# EAGLE design Sensor PCB (EAGLE 9.2.2)
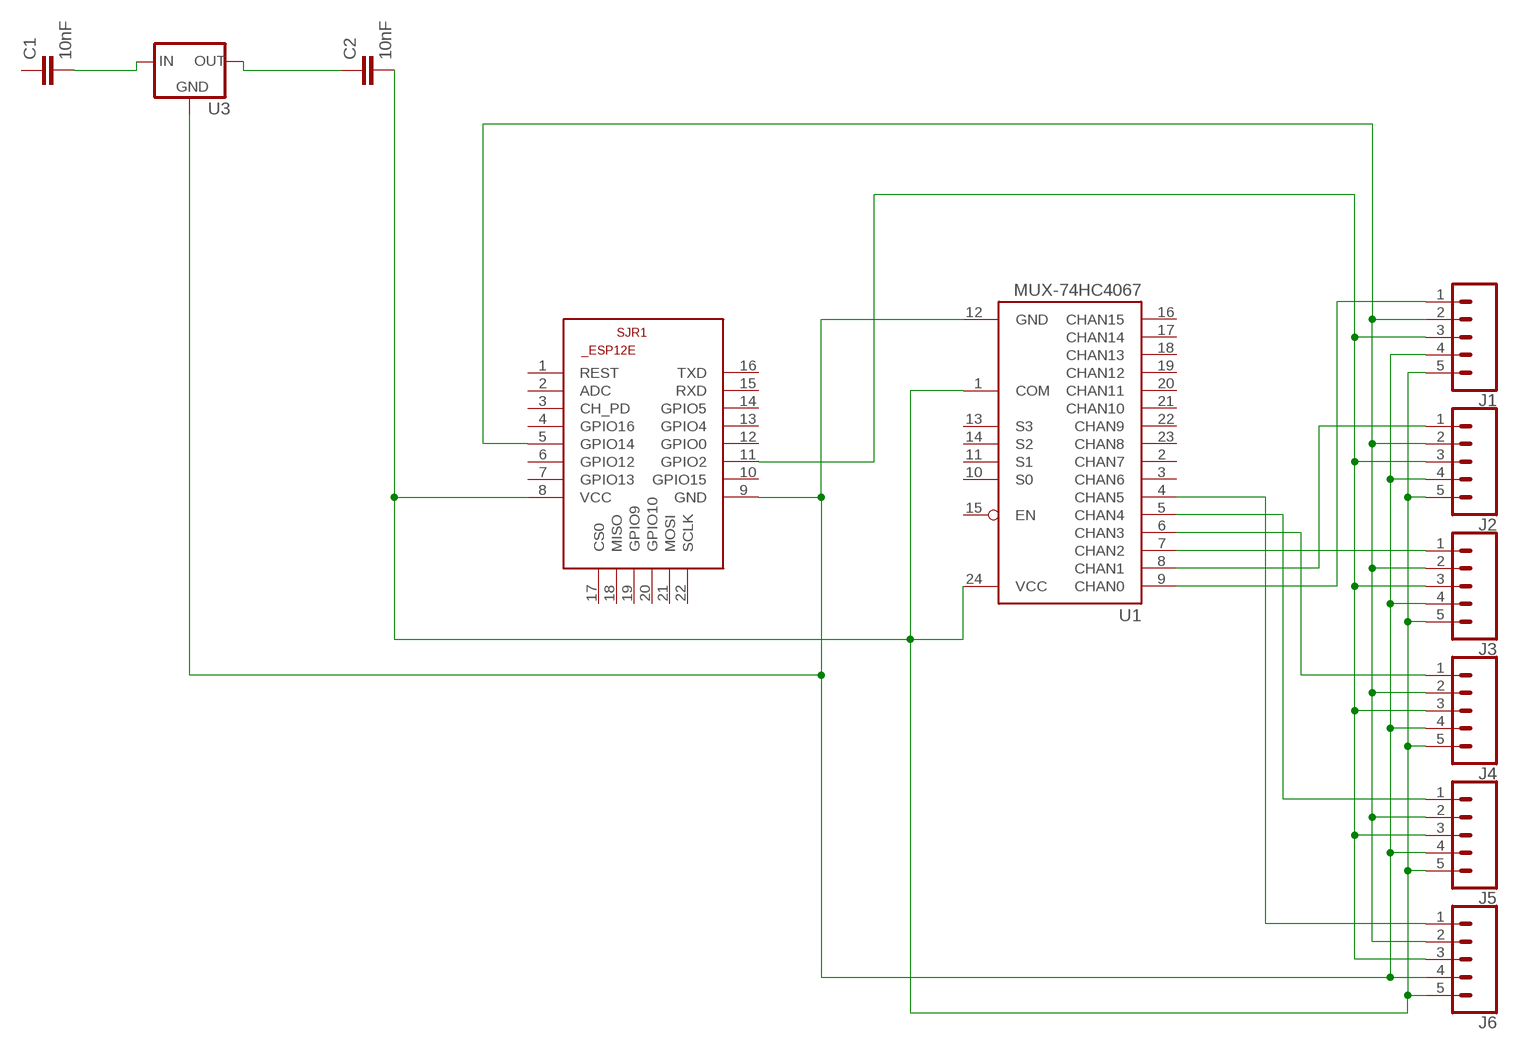
[diagram p0: schematic, sheet 1]

## Parts
C1  10nF  10NF-0603-50V-10%  [0603]
C2  10nF  10NF-0603-50V-10%  [0603]
J1  CONN_05JST-VERT  [JST-5-PTH-VERT]
J2  CONN_05JST-VERT  [JST-5-PTH-VERT]
J3  CONN_05JST-VERT  [JST-5-PTH-VERT]
J4  CONN_05JST-VERT  [JST-5-PTH-VERT]
J5  CONN_05JST-VERT  [JST-5-PTH-VERT]
J6  CONN_05JST-VERT  [JST-5-PTH-VERT]
SJR1  ESP8266-12EESP12E  [ESP8266-ESP12E]
U1  MUX-74HC4067  MUX-74HC4067SMD  [SSOP24]
U3  V_REG_78XX-TO-220  [TO-220-ALT]

## Nets
N$1: C1.2 U3.IN
N$2: C2.1 U3.OUT
N$3: C2.2 J1.5 J2.5 J3.5 J4.5 J5.5 J6.5 SJR1.8(VCC) U1.1(COM) U1.24(VCC)
N$4: J6.1 U1.4(CHAN5)
N$6: J1.3 J2.3 J3.3 J4.3 J5.3 J6.3 SJR1.11(GPIO2)
N$13: J1.2 J2.2 J3.2 J4.2 J5.2 J6.2 SJR1.5(GPIO14)
N$15: J1.1 U1.9(CHAN0)
N$16: J1.4 J2.4 J3.4 J4.4 J5.4 J6.4 SJR1.9(GND) U1.12(GND) U3.GND
N$17: J2.1 U1.8(CHAN1)
N$18: J3.1 U1.7(CHAN2)
N$19: J4.1 U1.6(CHAN3)
N$20: J5.1 U1.5(CHAN4)
Unconnected: C1.1 SJR1.1(REST) SJR1.2(ADC) SJR1.3(CH_PD) SJR1.4(GPIO16) SJR1.6(GPIO12) SJR1.7(GPIO13) SJR1.10(GPIO15) SJR1.12(GPIO0) SJR1.13(GPIO4) SJR1.14(GPIO5) SJR1.15(RXD) SJR1.16(TXD) SJR1.17(CS0) SJR1.18(MISO) SJR1.19(GPIO9) SJR1.20(GPIO10) SJR1.21(MOSI) SJR1.22(SCLK) U1.2(CHAN7) U1.3(CHAN6) U1.10(S0) U1.11(S1) U1.13(S3) U1.14(S2) U1.15(EN) U1.16(CHAN15) U1.17(CHAN14) U1.18(CHAN13) U1.19(CHAN12) U1.20(CHAN11) U1.21(CHAN10) U1.22(CHAN9) U1.23(CHAN8)

## Library data of the parts
C1 C2 = SparkFun-Capacitors:10NF: 0.01uF/10nF/10,000pF ceramic capacitors A capacitor is a passive two-terminal electrical component used to store electrical energy temporarily in an electric field. CAP-09321; PROD_ID: CAP-00867
J1-J6 = SparkFun-Connectors:CONN_05: Multi connection point. Often used as Generic Header-pin footprint for 0.1 inch spaced/style header connections On any of the 0.1 inch spaced packages, you can populate with these: Break Away Headers - Straight <https://www.sparkfun.com/products/116> (PRT-00116) Break Away Male Headers - Right Angle <https://www.sparkfun.com/products/553> (PRT-00553) Female Headers <https://www.sparkfun.com/products/115> (PRT-00115) Break Away Headers - Machine Pin <https://www.sparkfun.com/products/117> (PRT-00117) Break Away Female Headers - Swiss Machine Pin <https://www.sparkfun.com/products/743> (PRT-00743) For SCREWTERMINALS and SPRING TERMINALS visit here: Screw Terimnals on SparkFun.com <https://www.sparkfun.com/search/results?term=Screw+Terminals> (5mm/3.5mm/2.54mm spacing) This device is also useful as a general connection point to wire up your design to another part of your project. Our various solder wires solder well into these plated through hole pads. Hook-Up Wire - Assortment (Stranded, 22 AWG) <https://www.sparkfun.com/products/11375> (PRT-11375) Hook-Up Wire - Assortment (Solid Core, 22 AWG) <https://www.sparkfun.com/products/11367> (PRT-11367) View the entire wire category on our website here <https://www.sparkfun.com/categories/141> Special notes: Molex polarized connector foot print use with SKU : PRT-08231 with associated crimp pins and housings. 1MM SMD Version SKU: PRT-10208
SJR1 = esp12e:ESP8266-12E: ESP8266-12E Library for Eagle CAD The author not responsible for any damages or errors!. Created by Suhail jr.lt;/author>
U1 = SparkFun:MUX-74HC4067
U3 = SparkFun-IC-Power:V_REG_78XX: Voltage Regulator Standard 78xx regulator. IGO (Input Ground Output). Spark Fun Electronics SKU : COM-00107; PROD_ID: VREG-08450; SF_ID: COM-00107

## Board
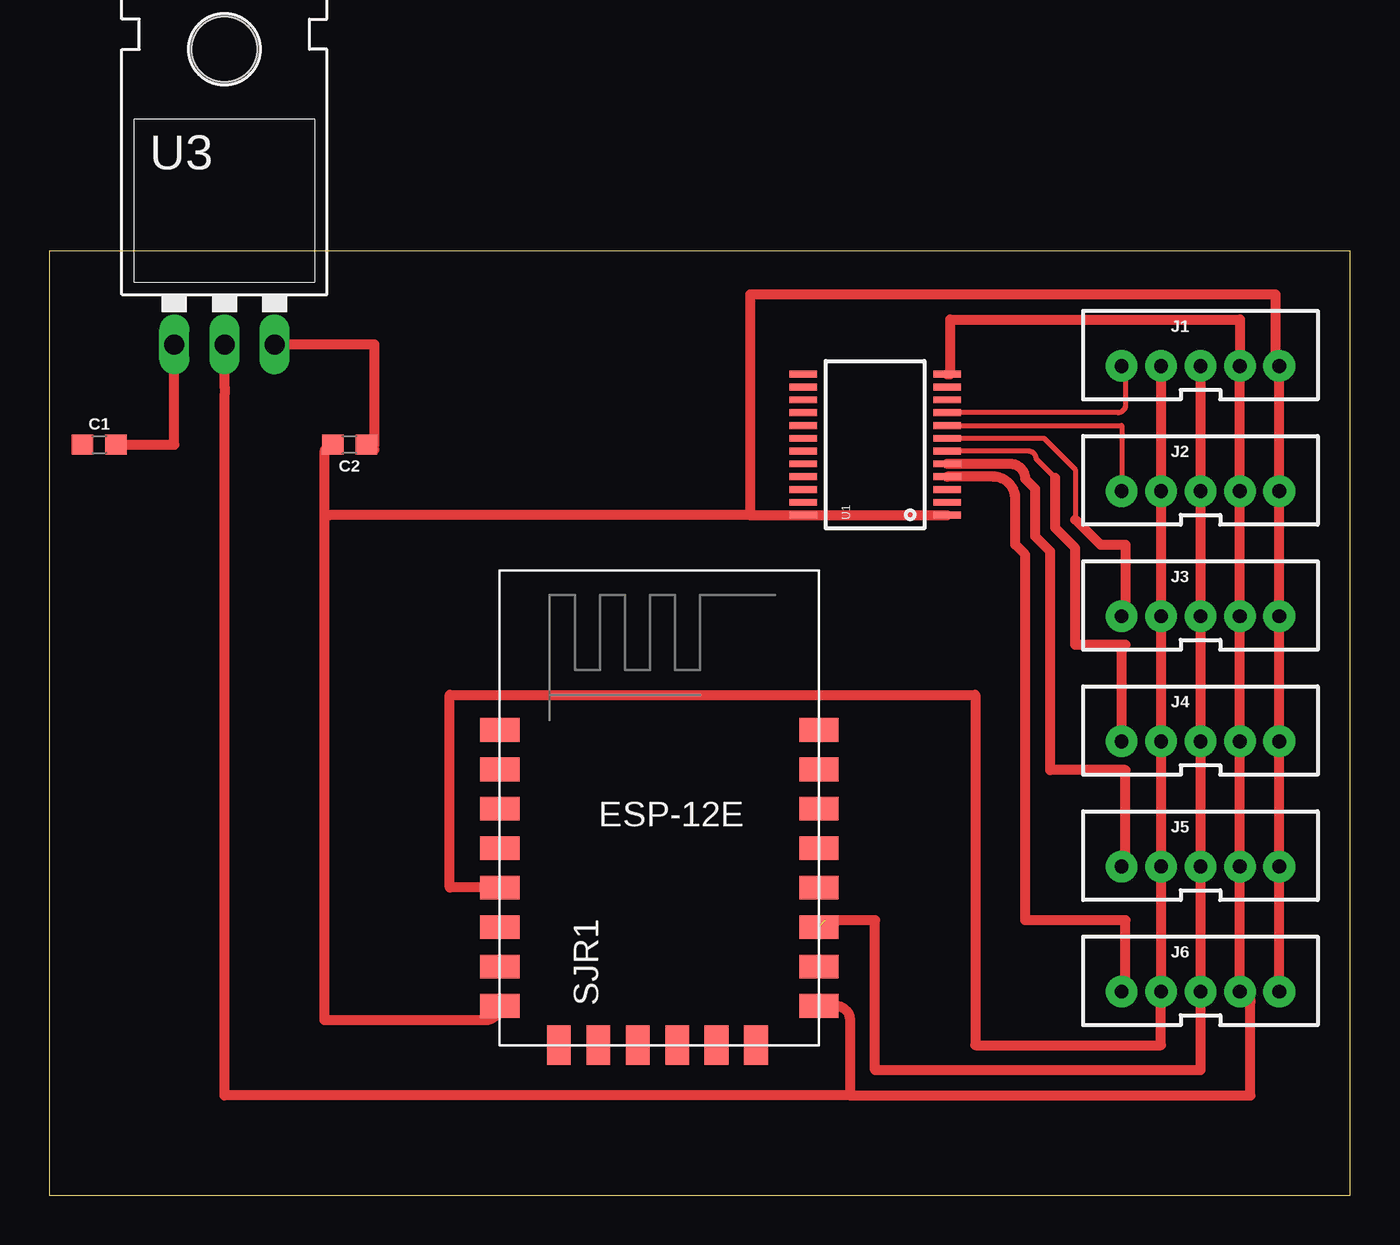
[diagram p1: board, top side]

Size 66.02 x 47.93 mm. Coordinates in mm from the lower left corner, seen from the top.
Outline: 0,0 66.02,0 66.02,47.93 0,47.93 0,0
Copper layers (1*16): Top 0.035mm / dielectric 1.5mm / Bottom 0.035mm
Design rules "default *": minimum track width 20mil, minimum drill 0.35mm, track to track 6mil, track to pad 6mil, pad to pad 6mil, via to via 6mil, smd to smd 6mil, copper to edge 20mil, drill to drill 6mil, minimum pad ring 10mil, minimum via ring 8mil, stop-mask expansion 4mil, vias tented up to drill 0mil, thermal gap 10mil

### Footprints (pad centres in the part's own frame; a part is rotated, then mirrored left to right if it is on the bottom)
0603 = smd 1.1 x 1: 1 -0.85,0; 2 0.85,0
JST-5-PTH-VERT = drill 0.7 pad 1.6: 1 -4,0.18; 2 -2,0.18; 3 0,0.18; 4 2,0.18; 5 4,0.18
ESP8266-ESP12E = smd 2 x 1.2: 1 -7.62,5.84; 2 -7.62,3.84; 3 -7.62,1.84; 4 -7.62,-0.16; 5 -7.62,-2.16; 6 -7.62,-4.16; 7 -7.62,-6.16; 8 -7.62,-8.16; 9 8.58,-8.16; 10 8.58,-6.16; 11 8.58,-4.16; 12 8.58,-2.16; 13 8.58,-0.16; 14 8.58,1.84; 15 8.58,3.84; 16 8.58,5.84 | smd 1.2 x 2: 17 -4.62,-10.16; 18 -2.62,-10.16; 19 -0.62,-10.16; 20 1.38,-10.16; 21 3.38,-10.16; 22 5.38,-10.16
SSOP24 = smd 0.348 x 1.397: 1 -3.575,-3.656; 2 -2.925,-3.656; 3 -2.275,-3.656; 4 -1.625,-3.656; 5 -0.975,-3.656; 6 -0.325,-3.656; 7 0.325,-3.656; 8 0.975,-3.656; 9 1.625,-3.656; 10 2.275,-3.656; 11 2.925,-3.656; 12 3.575,-3.656; 13 3.575,3.656; 14 2.925,3.656; 15 2.275,3.656; 16 1.625,3.656; 17 0.975,3.656; 18 0.325,3.656; 19 -0.325,3.656; 20 -0.975,3.656; 21 -1.625,3.656; 22 -2.275,3.656; 23 -2.925,3.656; 24 -3.575,3.656
TO-220-ALT = drill 1.016 long: GND 0,-3.81; IN -2.54,-3.81; OUT 2.54,-3.81 | hole 3.302: 0,11.176

### Placement (x,y rotation side)
C1  2.54,38.1 0 top
C2  15.24,38.1 180 top
J1  58.42,41.91 0 top
J2  58.42,35.56 0 top
J3  58.42,29.21 0 top
J4  58.42,22.86 0 top
J5  58.42,16.51 0 top
J6  58.42,10.16 0 top
SJR1  30.48,17.78 0 top
U1  41.91,38.1 90 top
U3  8.89,46.99 0 top

### Tracks (layer width: path | path; a pad name or v marks a point on that pad's centre or on a via)
N$1
  Top 0.508: C1.2 6.35,38.1 U3.IN
N$2
  Top 0.508: 16.51,37.85 C2.1 16.51,38.1 16.51,43.18 U3.OUT
N$3
  Top 0.508: 62.23,10.15 arc-90 J6.5 J5.5 J4.5 J3.5 J2.5 J1.5 62.23,42.09 62.23,45.72 35.56,45.72 35.56,34.52 | 35.56,34.52 U1.24 U1.1 | SJR1.8 arc-90 22.13,8.89 13.97,8.89 13.97,34.29 | 35.56,34.52 14.21,34.52 arc90 13.97,34.29 | 13.97,34.29 13.97,37.68 arc-90 C2.2
N$4
  Top 0.508: J6.1 arc90 54.61,10.53 54.61,13.97 49.53,13.97 49.53,32.52 49.02,33.03 49.02,35.35 arc90 47.9,36.48 U1.4
N$6  (1 unrouted)
  Top 0.508: J1.3 J2.3 J3.3 J4.3 J5.3 J6.3 58.42,6.35 41.91,6.35 41.91,13.97 39.37,13.97
N$13
  Top 0.508: J1.2 J2.2 J3.2 J4.2 J5.2 J6.2 56.42,7.62 46.99,7.62 46.99,25.4 20.32,25.4 20.32,15.62 SJR1.5
N$15
  Top 0.254: 54.61,41.91 54.61,40.09 arc-90 54.24,39.73 U1.9
  Top 0.508: J1.1 54.61,41.91
N$16
  Top 0.508: SJR1.9 39.91,9.62 arc-90 40.64,8.89 40.64,5.08 | 40.64,5.08 60.96,5.08 60.96,9.8 arc90 J6.4 J5.4 J4.4 J3.4 J2.4 J1.4 60.42,44.45 45.72,44.45 45.72,41.67 U1.12 | 40.64,5.08 8.89,5.08 8.89,40.64 8.89,41.05 U3.GND
N$17
  Top 0.254: U1.8 54.42,39.08 J2.1
N$18
  Top 0.254: U1.7 50.48,38.42 52.07,36.83 52.07,34.29
  Top 0.508: 52.07,34.29 53.34,33.02 54.61,33.02 54.61,29.58 J3.1
N$19
  Top 0.254: 51.05,36.41 50.08,37.38 arc90 49.69,37.77 U1.6
  Top 0.508: J4.1 54.42,27.75 54.61,27.94 52.07,27.94 52.07,32.85 51.05,33.87 51.05,36.41
N$20
  Top 0.508: J5.1 arc90 54.61,16.88 54.61,21.59 50.8,21.59 50.8,32.69 50.04,33.45 50.04,35.86 49.53,36.37 arc90 48.77,37.12 U1.5